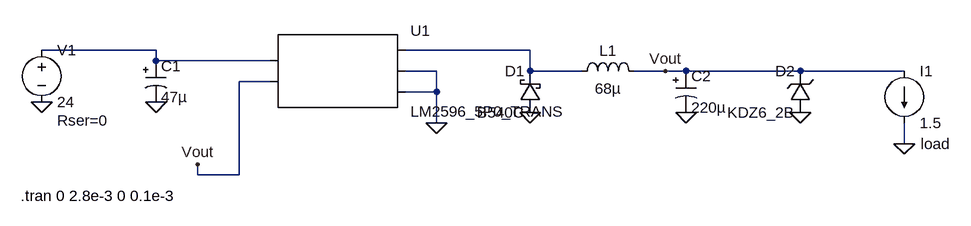
[diagram p0: schematic LM2596-5.asc]
LM2596-5.asc, the LTspice schematic file:
Version 4
SHEET 1 1188 680
WIRE -48 128 -224 128
WIRE 528 128 336 128
WIRE -48 144 -48 128
WIRE 128 144 -48 144
WIRE 384 160 336 160
WIRE 528 160 528 128
WIRE 608 160 528 160
WIRE 736 160 688 160
WIRE 768 160 736 160
WIRE 944 160 768 160
WIRE 1104 160 944 160
WIRE 128 176 80 176
WIRE 384 192 384 160
WIRE 384 192 336 192
WIRE 384 240 384 192
WIRE 1104 272 1104 240
WIRE 16 320 16 304
WIRE 80 320 80 176
WIRE 80 320 16 320
FLAG -224 208 0
FLAG -48 208 0
FLAG 528 224 0
FLAG 768 224 0
FLAG 384 240 0
FLAG 736 160 Vout
FLAG 16 304 Vout
FLAG 1104 272 0
FLAG 944 224 0
SYMBOL voltage -224 112 R0
WINDOW 123 0 0 Left 2
WINDOW 39 24 124 Left 2
SYMATTR SpiceLine Rser=0
SYMATTR InstName V1
SYMATTR Value 24
SYMBOL polcap -64 144 R0
WINDOW 3 24 56 Left 2
SYMATTR Value 47µ
SYMATTR InstName C1
SYMATTR Description Capacitor
SYMATTR Type cap
SYMATTR SpiceLine V=50 Irms=1.85 Rser=0.05 Lser=0
SYMBOL polcap 752 160 R0
WINDOW 3 24 56 Left 2
SYMATTR Value 220µ
SYMATTR InstName C2
SYMATTR Description Capacitor
SYMATTR Type cap
SYMATTR SpiceLine V=16 Irms=2.22261 Rser=0.05 Lser=0 mfg="KEMET" pn="T521X227M016ATE050" type="Tantalum"
SYMBOL schottky 544 224 R180
WINDOW 0 24 64 Left 2
WINDOW 3 24 0 Left 2
SYMATTR InstName D1
SYMATTR Value B540C
SYMATTR Description Diode
SYMATTR Type diode
SYMBOL ind 592 176 R270
WINDOW 0 32 56 VTop 2
WINDOW 3 5 56 VBottom 2
SYMATTR InstName L1
SYMATTR Value 68µ
SYMATTR SpiceLine Ipk=6.7 Rser=0.05762 Rpar=6405.6 Cpar=0
SYMBOL AutoGenerated\\LM2596_5P0_TRANS 224 160 R0
SYMATTR InstName U1
SYMBOL load2 1104 160 R0
WINDOW 123 0 0 Left 2
WINDOW 39 25 112 Left 2
SYMATTR SpiceLine load
SYMATTR InstName I1
SYMATTR Value 1.5
SYMBOL zener 960 224 R180
WINDOW 0 24 64 Left 2
WINDOW 3 24 0 Left 2
SYMATTR InstName D2
SYMATTR Value KDZ6_2B
SYMATTR Description Diode
SYMATTR Type diode
TEXT -256 352 Left 2 !.tran 0 2.8e-3 0 0.1e-3

The netlist it stands for:
* LM2596-5.asc
V1 N001 0 24 Rser=0
C1 N001 0 47µ V=50 Irms=1.85 Rser=0.05 Lser=0
C2 Vout 0 220µ V=16 Irms=2.22261 Rser=0.05 Lser=0 mfg="KEMET" pn="T521X227M016ATE050" type="Tantalum"
D1 0 N002 B540C
L1 N002 Vout 68µ Ipk=6.7 Rser=0.05762 Rpar=6405.6 Cpar=0
* U1: LM2596_5P0_TRANS (symbol AutoGenerated\LM2596_5P0_TRANS not available, pins judged from their places): pin1=N001 pin2=Vout pin3=N002 pin4=0 pin5=0
I1 Vout 0 1.5 load
D2 0 Vout KDZ6_2B
.model D D
.lib standard.dio
.tran 0 2.8e-3 0 0.1e-3
.backanno
.end